# Altium project Cargas AC ESP32.PrjPcb
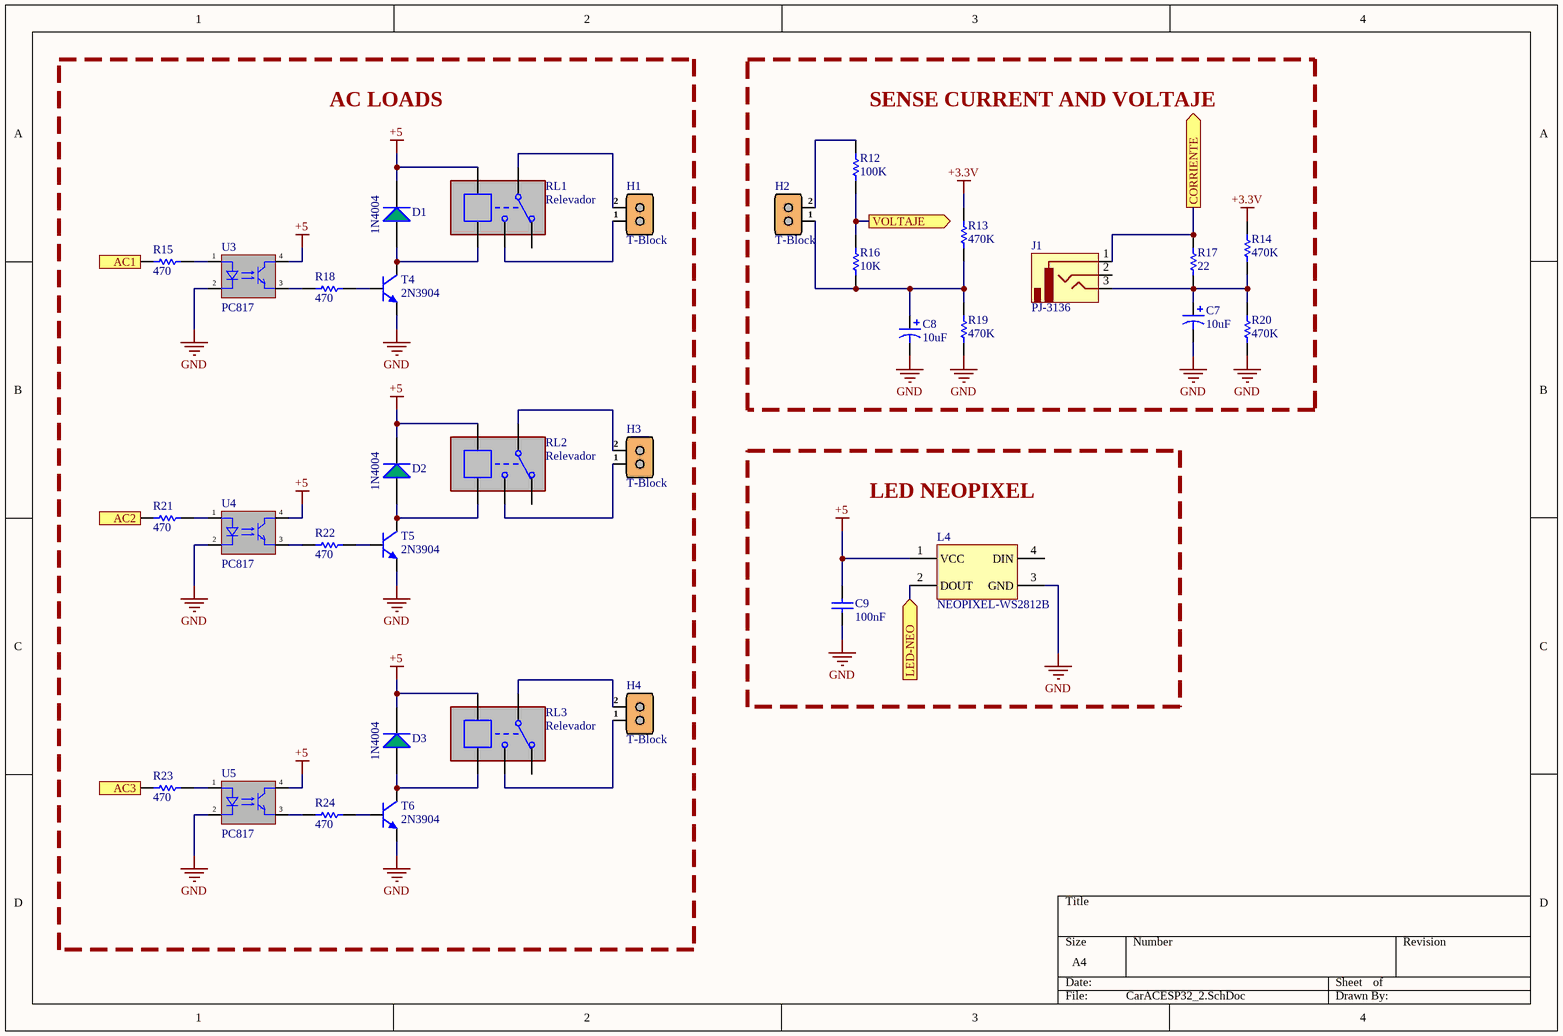
[diagram p0: CarACESP32_2.SchDoc]
1 sheet, 34 parts. Net scope: flat (ports and power ports of the same name join across sheets).
Board file: CarACESP32.PcbDoc

## Sheet CarACESP32_2.SchDoc
size A4; SheetNumber: 2; SheetTotal: 2

### Parts
C7  10uF  [100uF]
C8  10uF  [100uF]
C9  100nF  [Capacitor 1206]
D1  1N4004  [1N4007 SMD]
D2  1N4004  [1N4007 SMD]
D3  1N4004  [1N4007 SMD]
H1  T-Block  [TBLOCK-2ORANGE]
H2  T-Block  [TBLOCK-2ORANGE]
H3  T-Block  [TBLOCK-2ORANGE]
H4  T-Block  [TBLOCK-2ORANGE]
J1  PJ-3136  [PJ-3136-X]
L4  NEOPIXEL-WS2812B  [WS2812B]
R12  100K  [Resistencia 1206]
R13  470K  [Resistencia 1206]
R14  470K  [Resistencia 1206]
R15  470  [Resistencia 1206]
R16  10K  [Resistencia 1206]
R17  22  [Resistencia 1206]
R18  470  [Resistencia 1206]
R19  470K  [Resistencia 1206]
R20  470K  [Resistencia 1206]
R21  470  [Resistencia 1206]
R22  470  [Resistencia 1206]
R23  470  [Resistencia 1206]
R24  470  [Resistencia 1206]
RL1  Relevador  [Relevador Mini 20A]
RL2  Relevador  [Relevador Mini 20A]
RL3  Relevador  [Relevador Mini 20A]
T4  2N3904  [SOT23_M]
T5  2N3904  [SOT23_M]
T6  2N3904  [SOT23_M]
U3  PC817  [PC817]
U4  PC817  [PC817]
U5  PC817  [PC817]

### Blocks framed on the sheet
AC LOADS: D1-D3 H1 H3 H4 R15 R18 R21-R24 RL1-RL3 T4-T6 U3-U5
SENSE CURRENT AND VOLTAJE: C7 C8 H2 J1 R12-R14 R16 R17 R19 R20
LED NEOPIXEL: C9 L4

### Ports
AC1 (in), AC2 (in), AC3 (in), CORRIENTE (out), LED-NEO (in), VOLTAJE (out)

### Nets
+3.3V: R13.2(B) R14.2(B)
+5: C9.2 D1.2(C) D2.2(C) D3.2(C) L4.1(VCC) RL1.1 RL2.1 RL3.1 U3.4(C) U4.4(C) U5.4(C)
GND: C7.2 C8.2 C9.1 L4.3(GND) R19.1(A) R20.1(A) T4.2(E) T5.2(E) T6.2(E) U3.2(K) U4.2(K) U5.2(K)
NetC7_1: C7.1 J1.3 R14.1(A) R17.1(A) R20.2(B)
NetC8_1: C8.1 H2.1 R13.1(A) R16.1(A) R19.2(B)
NetD1_1: D1.1(A) RL1.2 T4.3(C)
NetD2_1: D2.1(A) RL2.2 T5.3(C)
NetD3_1: D3.1(A) RL3.2 T6.3(C)
NetH1_1: H1.1 RL1.4
NetH1_2: H1.2 RL1.3
NetH2_2: H2.2 R12.2(B)
NetH3_1: H3.1 RL2.4
NetH3_2: H3.2 RL2.3
NetH4_1: H4.1 RL3.4
NetH4_2: H4.2 RL3.3
NetJ1_1: J1.1 R17.2(B) ; port CORRIENTE
NetL4_2: L4.2(DOUT) ; port LED-NEO
NetR12_1: R12.1(A) R16.2(B) ; port VOLTAJE
NetR15_1: R15.1(A) U3.1(A)
NetR15_2: R15.2(B) ; port AC1
NetR18_1: R18.1(A) T4.1(B)
NetR18_2: R18.2(B) U3.3(E)
NetR21_1: R21.1(A) U4.1(A)
NetR21_2: R21.2(B) ; port AC2
NetR22_1: R22.1(A) T5.1(B)
NetR22_2: R22.2(B) U4.3(E)
NetR23_1: R23.1(A) U5.1(A)
NetR23_2: R23.2(B) ; port AC3
NetR24_1: R24.1(A) T6.1(B)
NetR24_2: R24.2(B) U5.3(E)

Not connected (* = marked no-connect by the designer): J1 2; L4 4(DIN); RL1 5; RL2 5; RL3 5

### Library data of the parts
C7 C8 = CAP-ELEC-100uF
C9 = Capacitor 1206: Capacitor cerámico 1206 SMD
D1-D3 = 1N4007 SMD: Diodo Rectificador
H1-H4 = T-Block 5.08mm 2P: Terminal de Bloque 2P 5.08mm
J1 = JACK HEMBRA 3.5MM: PJ-3136 Jack De Audio Hembra
L4 = NEOPIXEL-WS2812B: LED NEOPIXEL WS2812B
R12-R24 = Resistencia SMD 1206
RL1-RL3 = Relevador S 5V 20A: Relevador Mini
T4-T6 = MMBT2N3904
U3-U5 = PC817: Optoacoplador NPN